# EasyEDA schematic Main Schematic.json
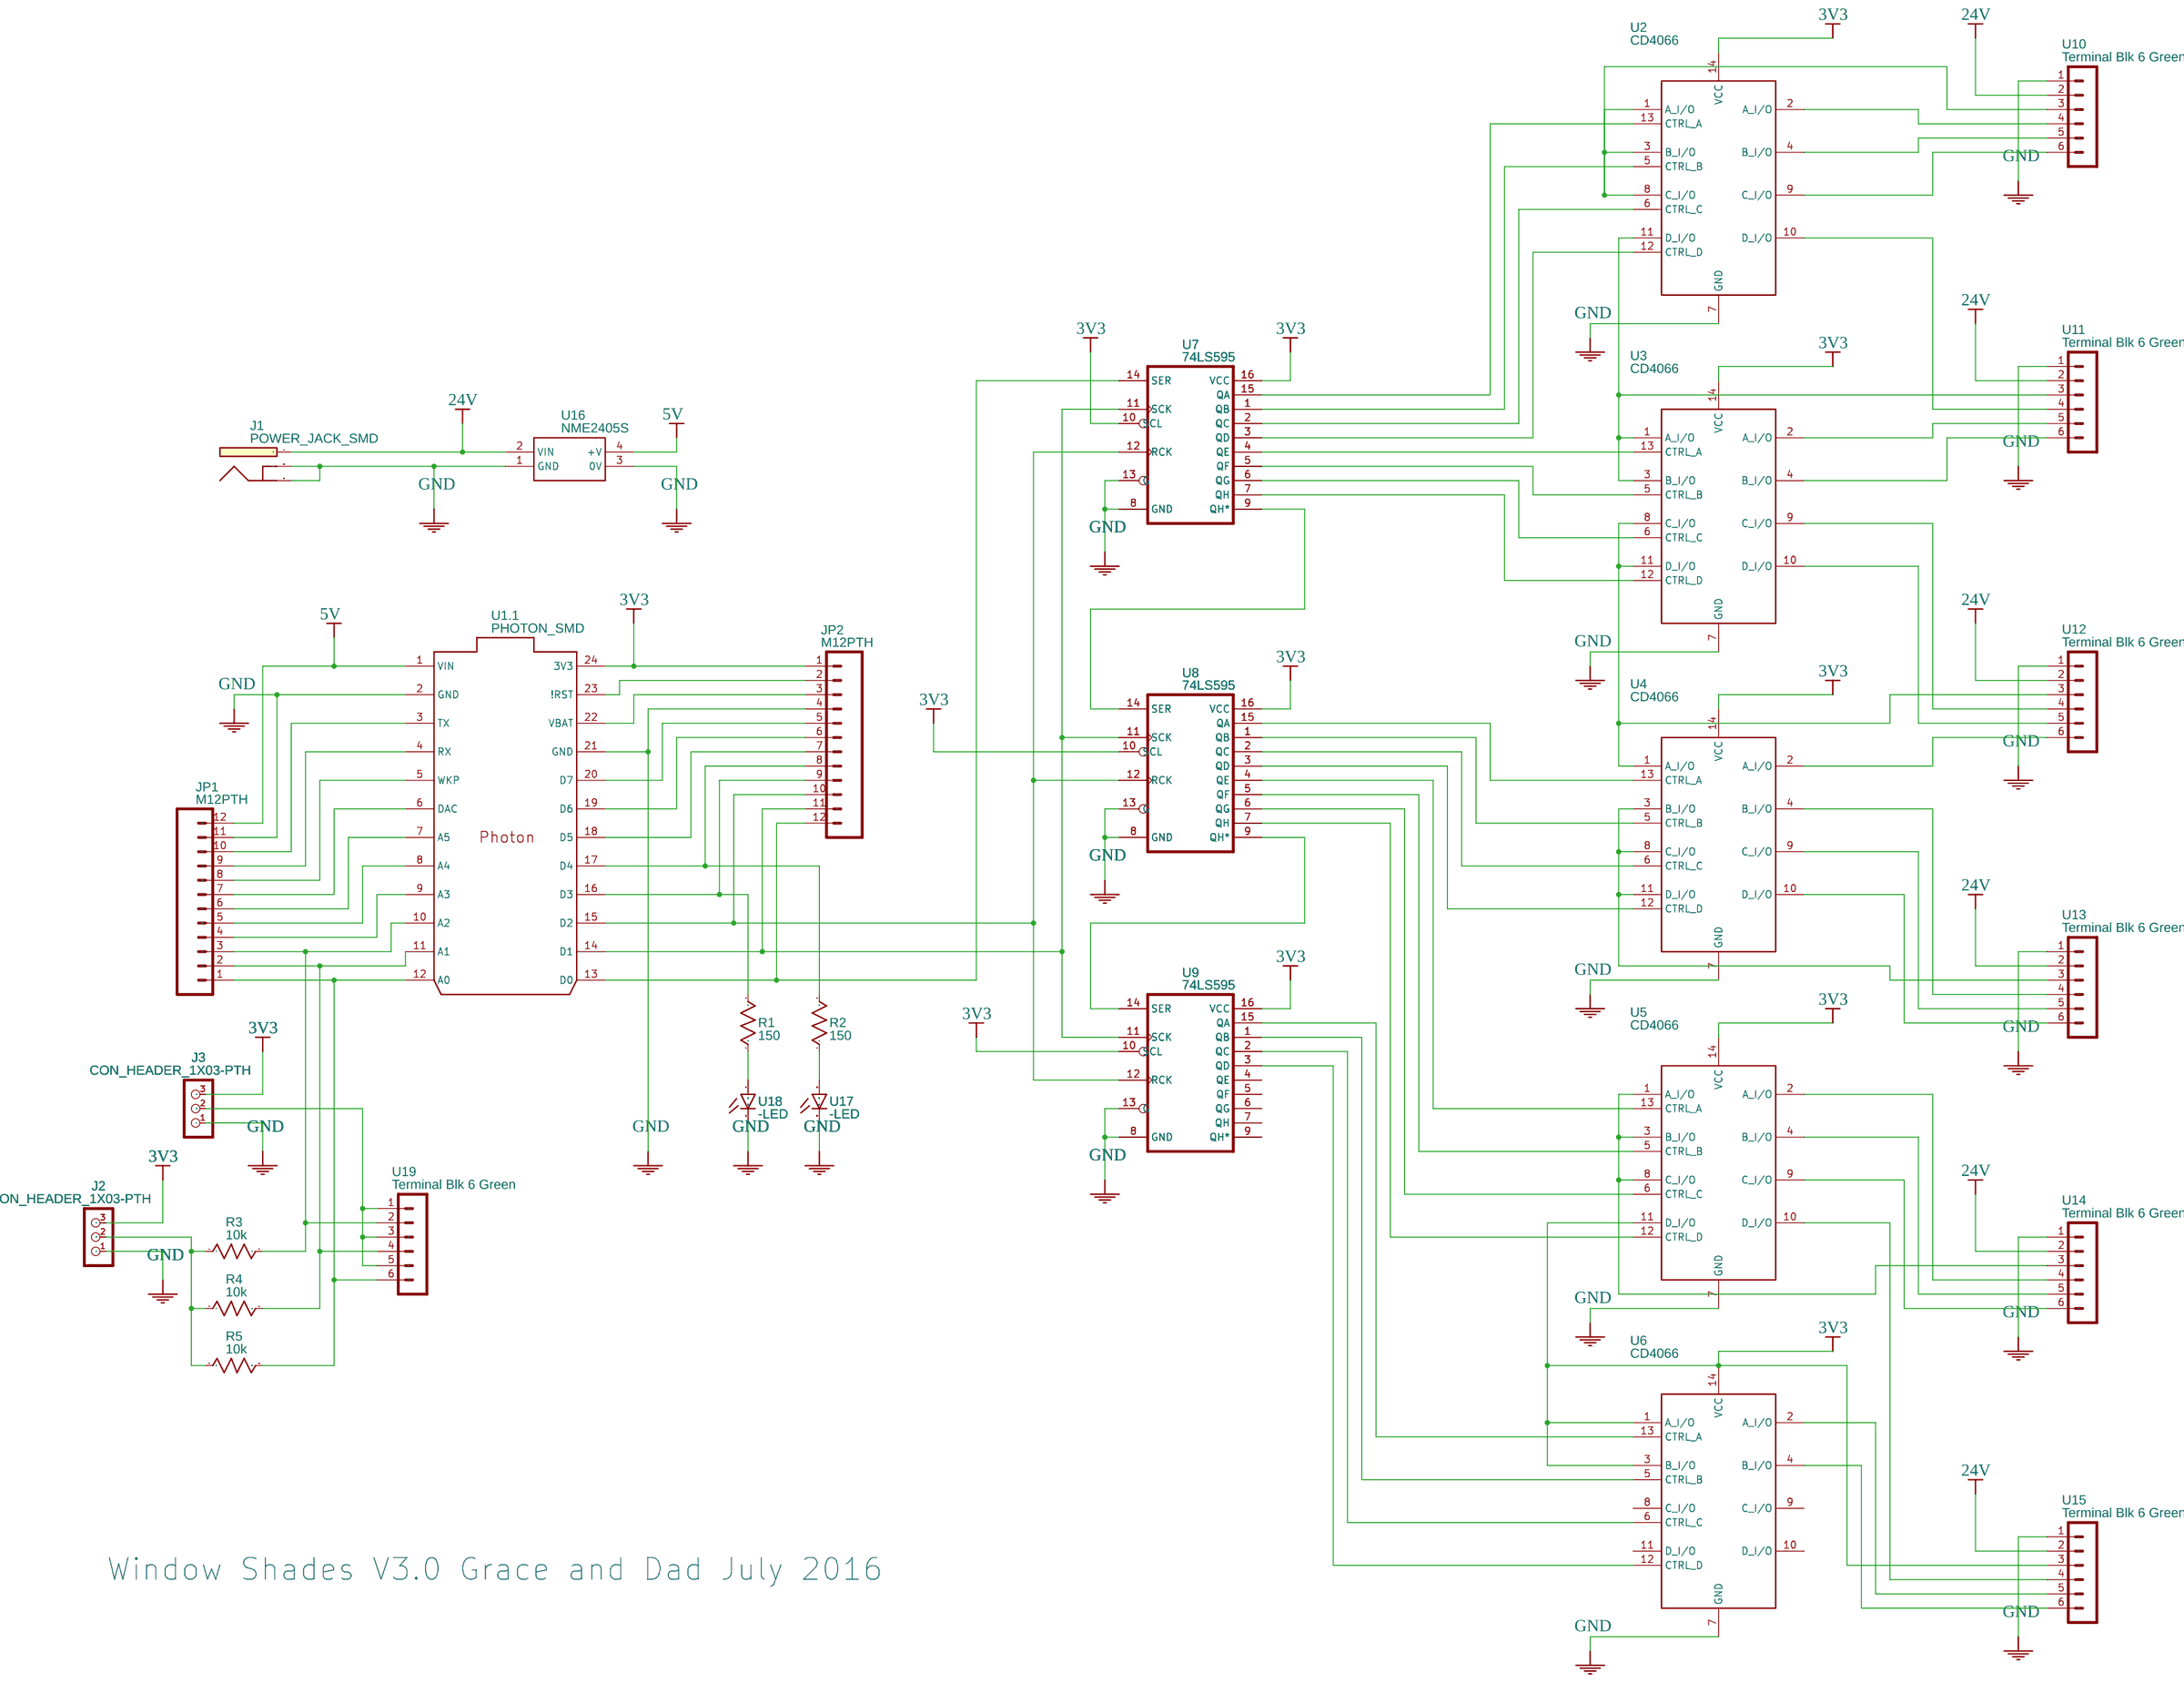
[diagram p0: schematic sheet]

## Parts
J1  POWER_JACK_SMD  [POWER_JACK_SMD]
J2  CON_HEADER_1X03-PTH  [M1X3]
J3  CON_HEADER_1X03-PTH  [M1X3]
JP1  M12PTH  [1X12]
JP2  M12PTH  [1X12]
R1  150  [R3]
R2  150  [R3]
R3  10k  [R3]
R4  10k  [R3]
R5  10k  [R3]
U1  PHOTON_SMD  [RedBear Duo]  (section 1)
U2  CD4066  [DIP14]
U3  CD4066  [DIP14]
U4  CD4066  [DIP14]
U5  CD4066  [DIP14]
U6  CD4066  [DIP14]
U7  74LS595  [DIL16]
U8  74LS595  [DIL16]
U9  74LS595  [DIL16]
U10  Terminal Blk 6 Green  [Terminal Blk 6 Green]
U11  Terminal Blk 6 Green  [Terminal Blk 6 Green]
U12  Terminal Blk 6 Green  [Terminal Blk 6 Green]
U13  Terminal Blk 6 Green  [Terminal Blk 6 Green]
U14  Terminal Blk 6 Green  [Terminal Blk 6 Green]
U15  Terminal Blk 6 Green  [Terminal Blk 6 Green]
U16  NME2405S  [NPSIP4]
U17  -LED  [LED5]
U18  -LED  [LED5]
U19  Terminal Blk 6 Green  [Terminal Blk 6 Green]

## Library data of the parts
J1 = -: catid: 20; Contributor: SparkFun; sourceId: kmkUfPzR9; Manufacturer Part: ?
J2 J3 = -: catid: 20; Contributor: DangerousPrototype; sourceId: DBvMGYgys; Manufacturer Part: ?
JP1 JP2 = -: Header 12; catid: 20; Contributor: SparkFun; sourceId: JFCca8usp; Manufacturer Part: ?
R1-R5 = Resistor: Manufacturer Part: ?
U1 = -: Photon (without headers) - designed to be surface mounted with 7 extra exposed pads on the bottom of the board which include, 3 RGB LED outputs, SETUP, EN (3.3V SMPS enable input), USB D+ and USB D-.; catid: 20; sourceId: fJfxrJ1iA; Manufacturer Part: ?
U2-U6 = CD4066: catid: 20; Contributor: stef.leininger; sourceId: Lt3pKIGEC; Manufacturer Part: ?
U7-U9 = -: catid: 20; Contributor: SparkFun; sourceId: CIUtrpnzx; Manufacturer Part: ?
U10-U15 U19 = -: 6 x 0.1 inch Header; catid: 20; Contributor: SparkFun; sourceId: q0hbtLFXf; Manufacturer Part: ?
U16 = -: Isolated 1W Single Output; catid: 20; sourceId: QdUegbEfT; Manufacturer Part: ?
U17 U18 = -: catid: 20; sourceId: N7HFeOoYy; Manufacturer Part: ?

## Nets
3V3: J2.3 J3.3 JP2.1 U1.24(3V3) U2.14(VCC) U3.14(VCC) U4.14(VCC) U5.11(D I/O) U5.14(VCC) U6.1(A I/O) U6.3(B I/O) U6.14(VCC) U7.10(SCL) U7.16(VCC) U8.10(SCL) U8.16(VCC) U9.10(SCL) U9.16(VCC) U15.3
5V: JP1.12 U1.1(VIN) U16.4(+V)
24V: J1.VIN U10.2 U11.2 U12.2 U13.2 U14.2 U15.2 U16.2(VIN)
GND: J1.GND J1.P$4(GND) J2.1 J3.1 JP1.11 JP2.4 U1.2(GND) U1.21(GND) U2.7(GND) U3.7(GND) U4.7(GND) U5.7(GND) U6.7(GND) U7.8(GND) U7.13(G) U8.8(GND) U8.13(G) U9.8(GND) U9.13(G) U10.1 U11.1 U12.1 U13.1 U14.1 U15.1 U16.1(GND) U16.3(0V) U17.CATHODE U18.CATHODE
Net-(J2-2): J2.2 R3.1 R4.1 R5.1
Net-(J3-2): J3.2 U19.1 U19.3 U19.5
Net-(JP1-1): JP1.1 R5.2 U1.12(A0) U19.6
Net-(JP1-2): JP1.2 R4.2 U1.11(A1) U19.4
Net-(JP1-3): JP1.3 R3.2 U1.10(A2) U19.2
Net-(JP1-4): JP1.4 U1.9(A3)
Net-(JP1-5): JP1.5 U1.8(A4)
Net-(JP1-6): JP1.6 U1.7(A5)
Net-(JP1-7): JP1.7 U1.6(DAC)
Net-(JP1-8): JP1.8 U1.5(WKP)
Net-(JP1-9): JP1.9 U1.4(RX)
Net-(JP1-10): JP1.10 U1.3(TX)
Net-(JP2-2): JP2.2 U1.23(!RST)
Net-(JP2-3): JP2.3 U1.22(VBAT)
Net-(JP2-5): JP2.5 U1.20(D7)
Net-(JP2-6): JP2.6 U1.19(D6)
Net-(JP2-7): JP2.7 U1.18(D5)
Net-(JP2-8): JP2.8 R2.2 U1.17(D4)
Net-(JP2-9): JP2.9 R1.2 U1.16(D3)
Net-(JP2-10): JP2.10 U1.15(D2) U7.12(RCK) U8.12(RCK) U9.12(RCK)
Net-(JP2-11): JP2.11 U1.14(D1) U7.11(SCK) U8.11(SCK) U9.11(SCK)
Net-(JP2-12): JP2.12 U1.13(D0) U7.14(SER)
Net-(R1-1): R1.1 U18.ANODE
Net-(R2-1): R2.1 U17.ANODE
Net-(U2-1): U2.1(A I/O) U2.3(B I/O) U2.8(C I/O) U10.3
Net-(U2-2): U2.2(A I/O) U10.4
Net-(U2-4): U2.4(B I/O) U10.5
Net-(U2-5): U2.5(CTRL B) U7.1(QB)
Net-(U2-6): U2.6(CTRL C) U7.2(QC)
Net-(U2-9): U2.9(C I/O) U10.6
Net-(U2-10): U2.10(D I/O) U11.4
Net-(U2-11): U2.11(D I/O) U3.1(A I/O) U3.3(B I/O) U11.3
Net-(U2-12): U2.12(CTRL D) U7.3(QD)
Net-(U2-13): U2.13(CTRL A) U7.15(QA)
Net-(U3-2): U3.2(A I/O) U11.5
Net-(U3-4): U3.4(B I/O) U11.6
Net-(U3-5): U3.5(CTRL B) U7.5(QF)
Net-(U3-6): U3.6(CTRL C) U7.6(QG)
Net-(U3-8): U3.8(C I/O) U3.11(D I/O) U4.1(A I/O) U12.3
Net-(U3-9): U3.9(C I/O) U12.4
Net-(U3-10): U3.10(D I/O) U12.5
Net-(U3-12): U3.12(CTRL D) U7.7(QH)
Net-(U3-13): U3.13(CTRL A) U7.4(QE)
Net-(U4-2): U4.2(A I/O) U12.6
Net-(U4-3): U4.3(B I/O) U4.8(C I/O) U4.11(D I/O) U13.3
Net-(U4-4): U4.4(B I/O) U13.4
Net-(U4-5): U4.5(CTRL B) U8.1(QB)
Net-(U4-6): U4.6(CTRL C) U8.2(QC)
Net-(U4-9): U4.9(C I/O) U13.5
Net-(U4-10): U4.10(D I/O) U13.6
Net-(U4-12): U4.12(CTRL D) U8.3(QD)
Net-(U4-13): U4.13(CTRL A) U8.15(QA)
Net-(U5-1): U5.1(A I/O) U5.3(B I/O) U5.8(C I/O) U14.3
Net-(U5-2): U5.2(A I/O) U14.4
Net-(U5-4): U5.4(B I/O) U14.5
Net-(U5-5): U5.5(CTRL B) U8.5(QF)
Net-(U5-6): U5.6(CTRL C) U8.6(QG)
Net-(U5-9): U5.9(C I/O) U14.6
Net-(U5-10): U5.10(D I/O) U15.4
Net-(U5-12): U5.12(CTRL D) U8.7(QH)
Net-(U5-13): U5.13(CTRL A) U8.4(QE)
Net-(U6-2): U6.2(A I/O) U15.5
Net-(U6-4): U6.4(B I/O) U15.6
Net-(U6-5): U6.5(CTRL B) U9.1(QB)
Net-(U6-6): U6.6(CTRL C) U9.2(QC)
Net-(U6-12): U6.12(CTRL D) U9.3(QD)
Net-(U6-13): U6.13(CTRL A) U9.15(QA)
Net-(U7-9): U7.9(QH*) U8.14(SER)
Net-(U8-9): U8.9(QH*) U9.14(SER)

Not connected (* = marked no-connect by the designer): U6 8(C I/O) 9(C I/O) 10(D I/O) 11(D I/O); U9 4(QE) 5(QF) 6(QG) 7(QH) 9(QH*)

## Notes on the sheet
- Window Shades V3.0 Grace and Dad July 2016
